# EAGLE schematic stepatten (EAGLE 7.7.0)
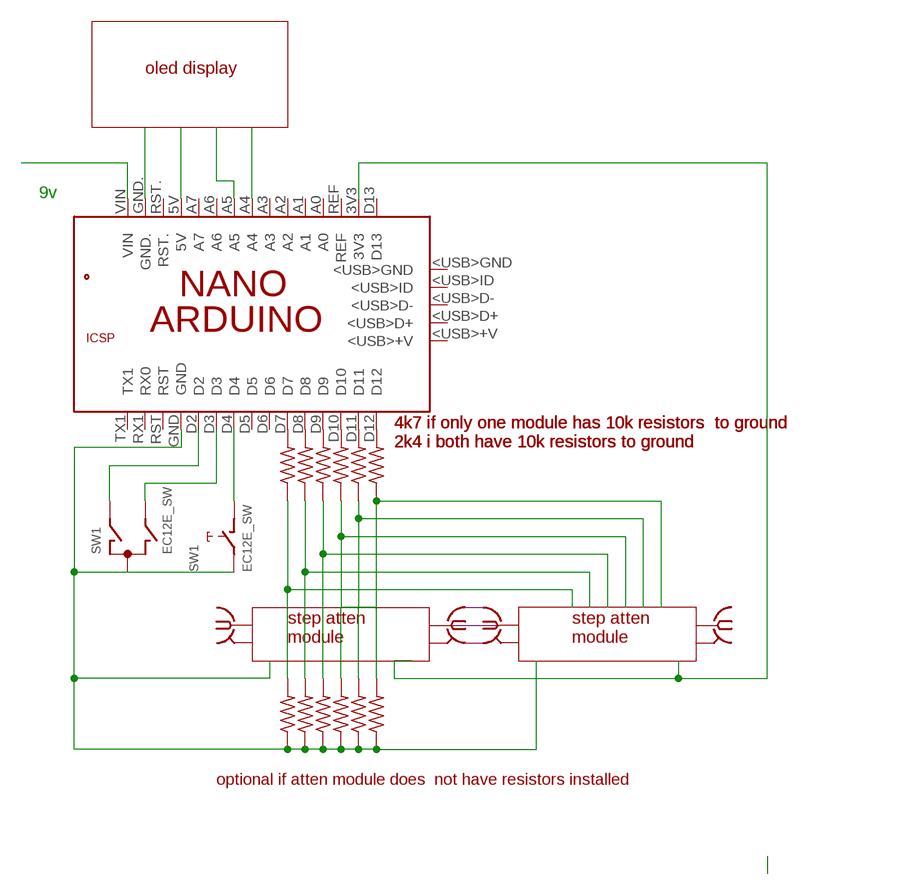
[diagram p0: schematic, sheet 1]

## Parts
PCB1  ARDUINO_NANO  [ARDUINO_NANO]
R1  R-US_M1206  [M1206]
R2  R-US_M1206  [M1206]
R3  R-US_M1206  [M1206]
R4  R-US_M1206  [M1206]
R5  R-US_M1206  [M1206]
R6  R-US_M1206  [M1206]
R7  R-US_M1206  [M1206]
R8  R-US_M1206  [M1206]
R9  R-US_M1206  [M1206]
R10  R-US_M1206  [M1206]
R11  R-US_M1206  [M1206]
R12  R-US_M1206  [M1206]
SW1  EC12E_SW  [ALPS_EC12E_SW]
X1  SMA-142-0701-801/806  [J502-ND-142-0701-801/806]
X2  SMA-142-0701-801/806  [J502-ND-142-0701-801/806]
X3  SMA-142-0701-801/806  [J502-ND-142-0701-801/806]
X4  SMA-142-0701-801/806  [J502-ND-142-0701-801/806]

## Nets
N$1: PCB1.D10 R1.2
N$2: PCB1.D9 R2.2
N$3: PCB1.D8 R3.2
N$4: PCB1.D7 R4.2
N$5: PCB1.D11 R6.2
N$6: PCB1.D12 R7.2
N$7: PCB1.D4 SW1.D
N$8: PCB1.D3 SW1.B
N$9: PCB1.D2 SW1.A
N$10: PCB1.GND R5.1 R8.1 R9.1 R10.1 R11.1 R12.1 SW1.E
N$11: R4.1 R12.2
N$12: R3.1 R11.2
N$13: R1.1 R5.2 R8.2 R9.2
N$15: R7.1
N$17: R6.1
N$18: R2.1 R10.2
Unconnected: PCB1.3V3 PCB1.5V PCB1.5V. PCB1.<USB>+V PCB1.<USB>D+ PCB1.<USB>D- PCB1.<USB>GND PCB1.<USB>ID PCB1.A0 PCB1.A1 PCB1.A2 PCB1.A3 PCB1.A4 PCB1.A5 PCB1.A6 PCB1.A7 PCB1.D5 PCB1.D6 PCB1.D13 PCB1.GND. PCB1.GND_ PCB1.MISO PCB1.MOSI PCB1.REF PCB1.RESET.. PCB1.RST PCB1.RST. PCB1.RX1(RX0) PCB1.SCK PCB1.TX1 PCB1.VIN SW1.C SW1.GND1(G) SW1.GND2(G) X1.1 X1.G@1 X1.G@2 X1.G@3 X1.G@4 X2.1 X2.G@1 X2.G@2 X2.G@3 X2.G@4 X3.1 X3.G@1 X3.G@2 X3.G@3 X3.G@4 X4.1 X4.G@1 X4.G@2 X4.G@3 X4.G@4

## Notes on the sheet
- oled display
- 9v
- 4k7 if only one module has 10k resistors  to ground
  2k4 i both have 10k resistors to ground
- 4k7 if only one module has 10k resistors  to ground
  2k4 i both have 10k resistors to ground
- 4k7 if only one module has 10k resistors  to ground
  2k4 i both have 10k resistors to ground
- step atten
  module
- step atten
  module
- optional if atten module does  not have resistors installed

## Library data of the parts
PCB1 = E14_Arduino_published:ARDUINO_NANO: Device for representing an Arduino Nano board with a footprint in an EAGLE design. Created by Dave Young for Element14. More EAGLE documentation at: http://www.element14.com/community/community/knode/cadsoft_eagle
R1-R12 = adafruit:R-US_: RESISTOR, American symbol
SW1 = switch-alps:EC12E_SW: ALPS rotary Encoder EC12E series with switch; MPN: EC12E2424407; OC_FARNELL: 1520813; OC_NEWARK: 74M1068
X1-X4 = con-coax:SMA-: SMA 50 Ohm End Launch Jack Receptacle - Round Contact Johnson Components Source: www.johnsoncomponents.com .. J502-ND.pdf; MF: JOHNSON COMPONENTS; MPN: 142-0701-801; OC_FARNELL: 1608592; OC_NEWARK: 90F2624